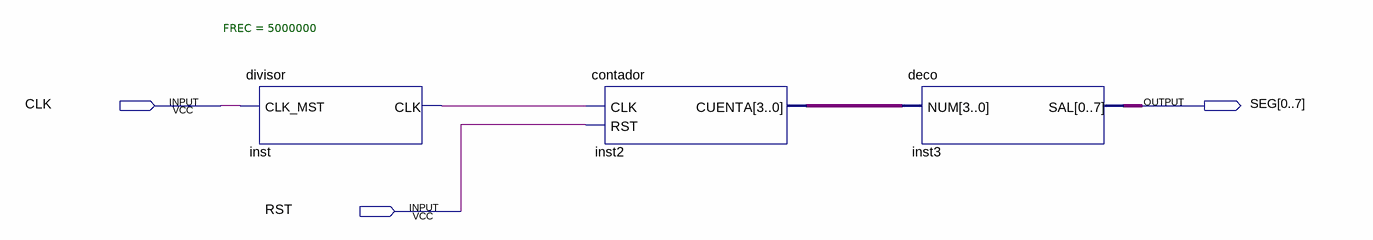
[diagram p0: schematic sheet]
// Quartus schematic main.bdf as structural Verilog: 3 symbols, 3 pins
module main (
  input  CLK,
  input  RST,
  output [0:7] SEG
);

  wire inst_clk;
  wire [3:0] inst2_cuenta;

  divisor #(.FREC(5000000)) inst (.CLK_MST(CLK), .CLK(inst_clk));
  contador inst2 (.CLK(inst_clk), .RST(RST), .CUENTA(inst2_cuenta));
  deco inst3 (.NUM(inst2_cuenta), .SAL(SEG));
endmodule
